# EAGLE schematic IronDue (EAGLE 9.0.1)
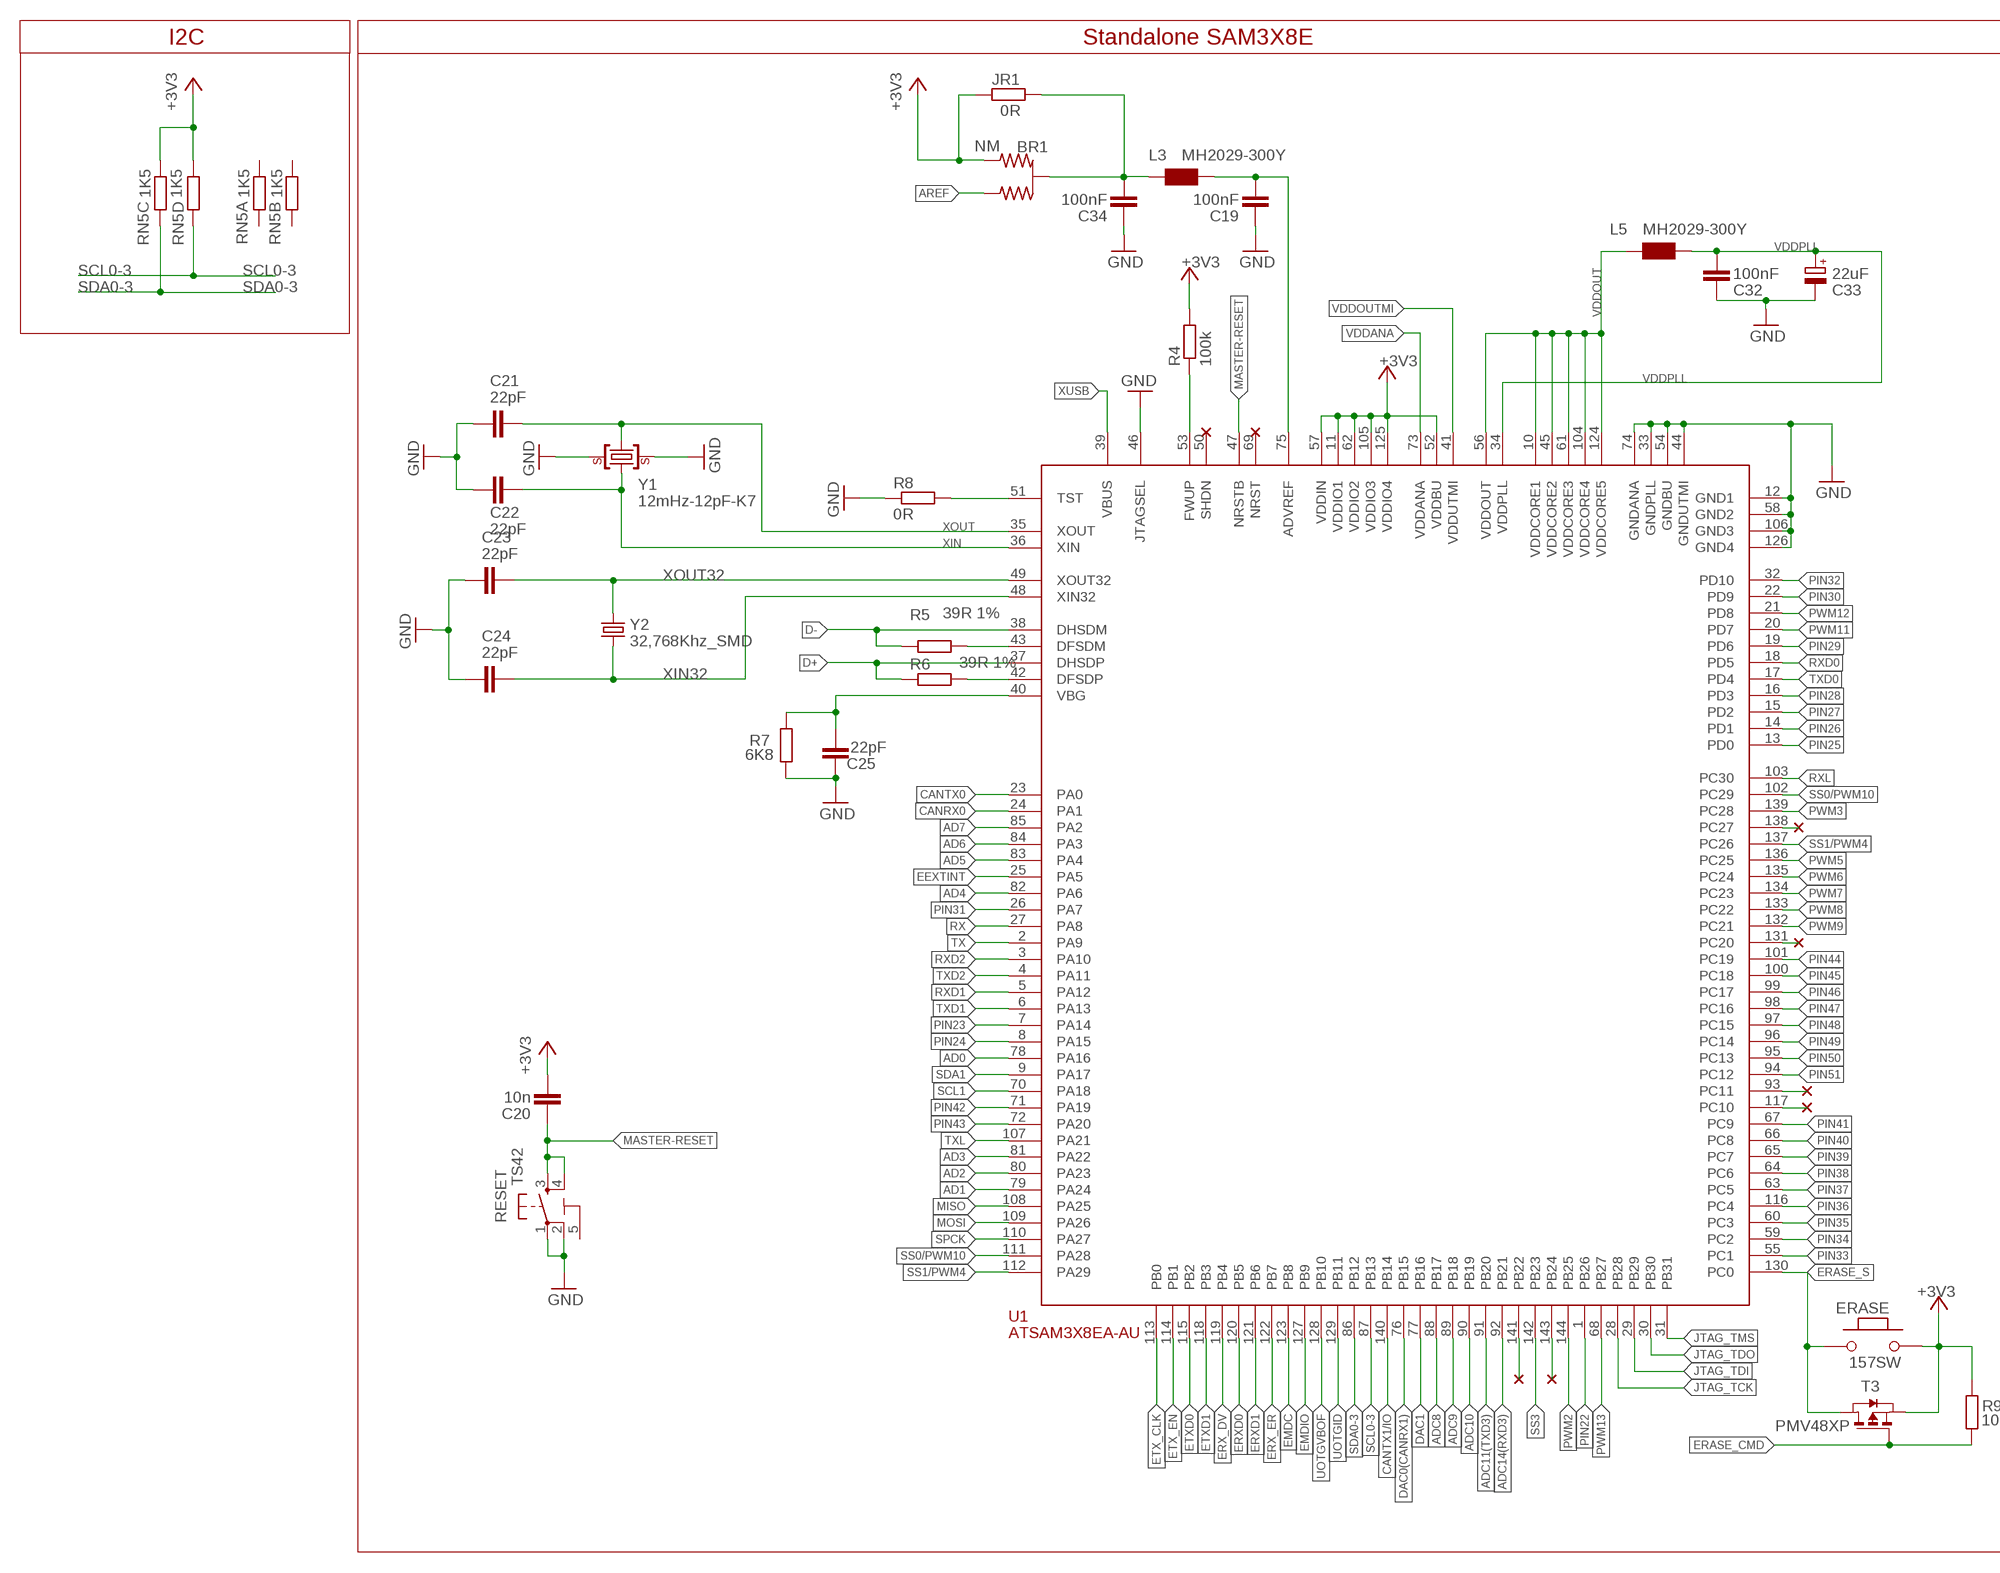
[diagram p0: schematic, sheet 1, part 1 of 2]
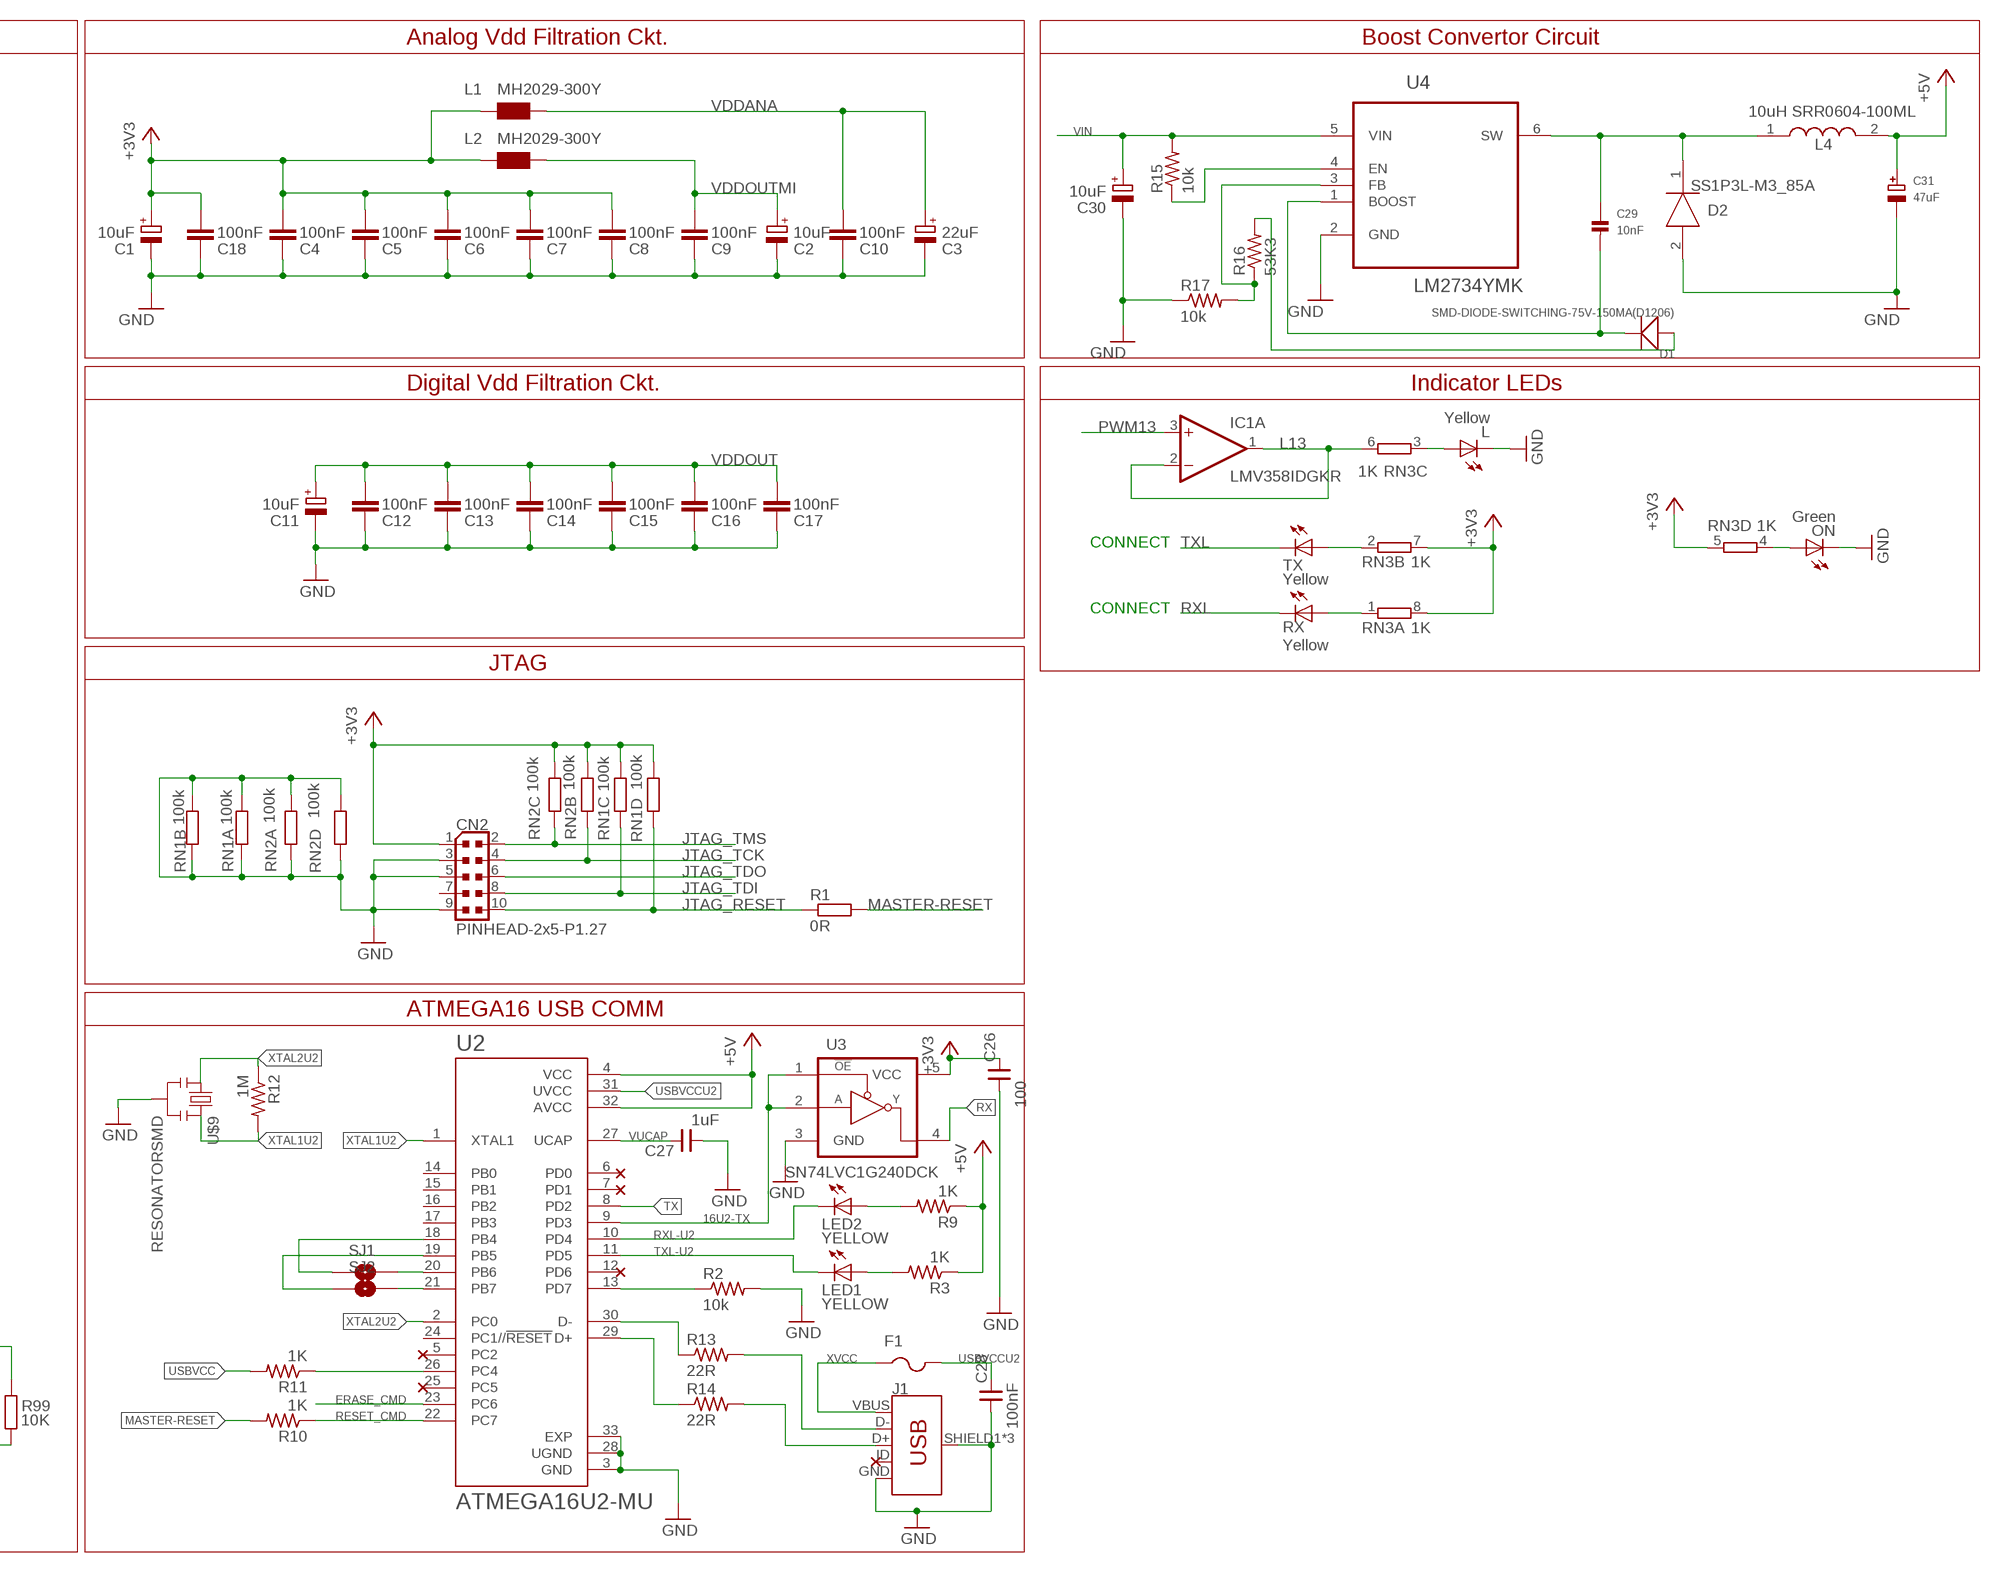
[diagram p1: schematic, sheet 1, part 2 of 2]

## Parts
BR1  NM  J0402  [J0402]
C1  10uF  0167_  [SMC_B]
C2  10uF  0167_  [SMC_B]
C3  22uF  0167_  [SMC_B]
C4  100nF  0132_100NF_0402  [C0402]
C5  100nF  0132_100NF_0402  [C0402]
C6  100nF  0132_100NF_0402  [C0402]
C7  100nF  0132_100NF_0402  [C0402]
C8  100nF  0132_100NF_0402  [C0402]
C9  100nF  0132_100NF_0402  [C0402]
C10  100nF  0132_100NF_0402  [C0402]
C11  10uF  0167_  [SMC_B]
C12  100nF  0132_100NF_0402  [C0402]
C13  100nF  0132_100NF_0402  [C0402]
C14  100nF  0132_100NF_0402  [C0402]
C15  100nF  0132_100NF_0402  [C0402]
C16  100nF  0132_100NF_0402  [C0402]
C17  100nF  0132_100NF_0402  [C0402]
C18  100nF  0132_100NF_0402  [C0402]
C19  100nF  0132_100NF_0402  [C0402]
C20  10n  0165_10NF_0402  [C0402]
C21  22pF  0137_22PF_0402  [C0402]
C22  22pF  0137_22PF_0402  [C0402]
C23  22pF  0137_22PF_0402  [C0402]
C24  22pF  0137_22PF_0402  [C0402]
C25  22pF  0137_22PF_0402  [C0402]
C26  100  CNP-0402  [0402]
C27  1uF  CNP-0402  [0402]
C28  100nF  CNP-0402  [0402]
C29  10nF  CAP_CERAMIC0402  [0402]
C30  10uF  0167_  [SMC_B]
C31  47uF  CAP_ELECTROLYTICPANASONIC_D  [PANASONIC_D]
C32  100nF  0132_100NF_0402  [C0402]
C33  22uF  0167_  [SMC_B]
C34  100nF  0132_100NF_0402  [C0402]
CN2  PINHEAD-2x5-P1.27  0171_PH127-205DF055G00AROUND-PADS  [PINHEAD_2X05_127]
D1  SMD-DIODE-SWITCHING-75V-150MA(D1206)  [LED-1206]
D2  SS1P3L-M3_85A  [SMP]
ERASE  157SW  0173_IT-1185AP1C-160G-G_T&R  [SMD_157SW]
F1  MF-MSMF050-2 500mA  PTCFUSE-1812  [1812]
IC1  LMV358IDGKR  0021_LMV358IDGKR  [MSOP08]
J1  USB_MICRO-BREDUCED_PASTE  [USB-B-MICRO-SMD_RED_PASTE]
JR1  0R  0039_JUMP_0402  [R0402]
L  Yellow  0044_KPT-2012YC  [CHIPLED_0805]
L1  MH2029-300Y  0001_BLM21PG300SN1D_/_MH2029-300Y  [0805]
L2  MH2029-300Y  0001_BLM21PG300SN1D_/_MH2029-300Y  [0805]
L3  MH2029-300Y  0001_BLM21PG300SN1D_/_MH2029-300Y  [0805]
L4  10uH SRR0604-100ML  SRR0604-100ML  [SRR0604-SERIES]
L5  MH2029-300Y  0001_BLM21PG300SN1D_/_MH2029-300Y  [0805]
LED1  YELLOW  LEDCHIPLED_0805  [CHIPLED_0805]
LED2  YELLOW  LEDCHIPLED_0805  [CHIPLED_0805]
ON  Green  0043_KPT-2012SGC  [CHIPLED_0805]
R1  0R  0039_JUMP_0402  [R0402]
R2  10k  R-US_R0402  [R0402]
R3  1K  R-US_R0402  [R0402]
R4  100k  0134_CR0402FX1003L  [R0402]
R5  39R 1%  0138_39R_0402  [R0402]
R6  39R 1%  0138_39R_0402  [R0402]
R7  6K8  0164_6K8_0603  [R0603-ROUND]
R8  0R  0039_JUMP_0402  [R0402]
R9  1K  R-US_R0402  [R0402]
R10  1K  R-US_R0402  [R0402]
R11  1K  R-US_R0402  [R0402]
R12  1M  R-US_R0402  [R0402]
R13  22R  R-US_R0402  [R0402]
R14  22R  R-US_R0402  [R0402]
R15  10k  R-US_R0402  [R0402]
R16  53K3  R-US_R0603  [R0603]
R17  10k  R-US_R0603  [R0603]
R99  10K  0136_CR0402FX1002_L  [R0402]
RESET  TS42  0946_TS42031-160W-TR-7260  [TS42]
RN1  100k  0168_CAY16-104J4LF  [CAY16]
RN2  100k  0168_CAY16-104J4LF  [CAY16]
RN3  1K  0005_064R_1K_/_CAY16-102J4LF  [CAY16]
RN5  1K5  0163_1K5_ARRAY  [CAY16]
RX  Yellow  0044_KPT-2012YC  [CHIPLED_0805]
SJ1  SOLDERJUMPERNO  [SJ_2S-NO]
SJ2  SOLDERJUMPERNO  [SJ_2S-NO]
T3  PMV48XP  0297_PMV48XP  [SOT-23]
TX  Yellow  0044_KPT-2012YC  [CHIPLED_0805]
U1  ATSAM3X8EA-AU  0162_ATSAM3X8EA-AUAU  [LQFP144]
U2  ATMEGA16U2-MU  [QFN50P500X500X100-33N]
U3  SN74LVC1G240DCK  [SC70-5]
U4  LM2734YMK  [SOT95P285X100-6N]
U$1  NC  [NC]
U$2  NC  [NC]
U$3  NC  [NC]
U$4  NC  [NC]
U$5  NC  [NC]
U$6  NC  [NC]
U$7  NC  [NC]
U$8  NC  [NC]
U$9  RESONATORSMD  [RESONATOR-SMD]
U$10  NC  [NC]
U$11  NC  [NC]
U$12  NC  [NC]
U$13  NC  [NC]
U$14  NC  [NC]
U$15  NC  [NC]
Y1  12mHz-12pF-K7  0396_12MHZ-12PF-K7  [CRYSTAL-3.2-2.5]
Y2  32,768Khz_SMD  0213_ABS07-32.768KHZ-T  [RESONATOR_EPSON_FC_145]

## Nets
16U2-TX: U2.9(PD3) U3.1(OE#) U3.2(A)
+3V3: BR1.3 C1.+ C4.2 C5.2 C6.2 C7.2 C8.2 C18.2 C20.2 C26.2 CN2.1 ERASE.1 JR1.1 L1.1 L2.1 R4.2 R99.2 RN1.5 RN1.6 RN2.2 RN2.3 RN3.5 RN3.7 RN3.8 RN5.3 RN5.4 T3.2(S) U1.11(VDDIO1) U1.52(VDDBU) U1.57(VDDIN) U1.62(VDDIO2) U1.105(VDDIO3) U1.125(VDDIO4) U3.5(VCC)
+5V: C31.+ L4.2 R3.1 R9.1 U2.4(VCC) U2.32(AVCC)
AD0: U1.78(PA16)
AD1: U1.79(PA24)
AD2: U1.80(PA23)
AD3: U1.81(PA22)
AD4: U1.82(PA6)
AD5: U1.83(PA4)
AD6: U1.84(PA3)
AD7: U1.85(PA2)
ADC8: U1.88(PB17)
ADC9: U1.89(PB18)
ADC10: U1.90(PB19)
ADC11(TXD3): U1.91(PB20)
ADC14(RXD3): U1.92(PB21)
AREF: BR1.1
CANRX0: U1.24(PA1)
CANTX0: U1.23(PA0)
CANTX1/IO: U1.140(PB14)
D+: R6.1 U1.37(DHSDP)
D-: R5.1 U1.38(DHSDM)
DAC0(CANRX1): U1.76(PB15)
DAC1: U1.77(PB16)
EEXTINT: U1.25(PA5)
EMDC: U1.123(PB8)
EMDIO: U1.127(PB9)
ERASE_CMD: R99.1 T3.3(G) U2.23(PC6)
ERASE_S: ERASE.2 T3.1(D) U1.130(PC0)
ERX_DV: U1.119(PB4)
ERX_ER: U1.122(PB7)
ERXD0: U1.120(PB5)
ERXD1: U1.121(PB6)
ETX_CLK: U1.113(PB0)
ETX_EN: U1.114(PB1)
ETXD0: U1.115(PB2)
ETXD1: U1.118(PB3)
GND: C1.- C2.- C3.- C4.1 C5.1 C6.1 C7.1 C8.1 C9.1 C10.1 C11.- C12.1 C13.1 C14.1 C15.1 C16.1 C17.1 C18.1 C19.1 C21.2 C22.2 C23.2 C24.2 C25.2 C26.1 C27.1 C28.1 C30.- C31.- C32.1 C33.- C34.1 CN2.3 CN2.5 CN2.9 D2.2(K) J1.GND J1.SHIELD1(SHIELD) J1.SHIELD2(SHIELD) J1.SHIELD3(SHIELD) L.C ON.C R2.2 R7.1 R8.1 R17.1 RESET.1 RESET.2 RN1.1 RN1.2 RN1.7 RN1.8 RN2.1 RN2.4 RN2.5 RN2.8 U1.12(GND1) U1.33(GNDPLL) U1.44(GNDUTMI) U1.46(JTAGSEL) U1.54(GNDBU) U1.58(GND2) U1.74(GNDANA) U1.106(GND3) U1.126(GND4) U2.3(GND) U2.28(UGND) U2.33(EXP) U3.3(GND) U4.2(GND) U$9.2 Y1.2(GND) Y1.4(GND)
JTAG_RESET: CN2.10 R1.1 RN1.4
JTAG_TCK: CN2.4 RN2.7 U1.28(PB28)
JTAG_TDI: CN2.8 RN1.3 U1.29(PB29)
JTAG_TDO: CN2.6 U1.30(PB30)
JTAG_TMS: CN2.2 RN2.6 U1.31(PB31)
L13: IC1.1(A:OUT) IC1.2(A:-IN) RN3.6
MASTER-RESET: C20.1 R1.2 R10.2 RESET.3 RESET.4 U1.47(NRSTB)
MISO: U1.108(PA25)
MOSI: U1.109(PA26)
N$1: R4.1 U1.53(FWUP)
N$2: C19.2 L3.2 U1.75(ADVREF)
N$3: BR1.2(C) C34.2 JR1.2 L3.1
N$4: ON.A RN3.4
N$5: L.A RN3.3
N$6: U1.131(PC20)
N$7: U1.138(PC27)
N$8: U1.93(PC11)
N$9: U1.117(PC10)
N$10: U1.143(PB24)
N$11: U1.141(PB22)
N$12: R8.2 U1.51(TST)
N$13: R6.2 U1.42(DFSDP)
N$14: R5.2 U1.43(DFSDM)
N$15: C25.1 R7.2 U1.40(VBG)
N$16: R2.1 U2.13(PD7)
N$17: LED2.A R9.2
N$18: LED1.A R3.2
N$19: R11.1 U2.26(PC4)
N$20: R13.1 U2.30(D-)
N$21: R14.1 U2.29(D+)
N$22: J1.D+ R14.2
N$23: J1.D- R13.2
N$24: C29.2 D1.- U4.1(BOOST)
N$25: R16.1 R17.2 U4.3(FB)
N$26: SJ1.2 U2.20(PB6)
N$27: SJ2.2 U2.21(PB7)
N$28: SJ1.1 U2.18(PB4)
N$29: SJ2.1 U2.19(PB5)
N$30: C29.1 D2.1(A) L4.1 U4.6(SW)
N$31: D1.+ R16.2
N$32: R15.1 U4.4(EN)
N$54: RN3.1 RX.A
N$55: RN3.2 TX.A
PIN22: U1.1(PB26)
PIN23: U1.7(PA14)
PIN24: U1.8(PA15)
PIN25: U1.13(PD0)
PIN26: U1.14(PD1)
PIN27: U1.15(PD2)
PIN28: U1.16(PD3)
PIN29: U1.19(PD6)
PIN30: U1.22(PD9)
PIN31: U1.26(PA7)
PIN32: U1.32(PD10)
PIN33: U1.55(PC1)
PIN34: U1.59(PC2)
PIN35: U1.60(PC3)
PIN36: U1.116(PC4)
PIN37: U1.63(PC5)
PIN38: U1.64(PC6)
PIN39: U1.65(PC7)
PIN40: U1.66(PC8)
PIN41: U1.67(PC9)
PIN42: U1.71(PA19)
PIN43: U1.72(PA20)
PIN44: U1.101(PC19)
PIN45: U1.100(PC18)
PIN46: U1.99(PC17)
PIN47: U1.98(PC16)
PIN48: U1.97(PC15)
PIN49: U1.96(PC14)
PIN50: U1.95(PC13)
PIN51: U1.94(PC12)
PWM2: U1.144(PB25)
PWM3: U1.139(PC28)
PWM5: U1.136(PC25)
PWM6: U1.135(PC24)
PWM7: U1.134(PC23)
PWM8: U1.133(PC22)
PWM9: U1.132(PC21)
PWM11: U1.20(PD7)
PWM12: U1.21(PD8)
PWM13: IC1.3(A:+IN) U1.68(PB27)
RESET_CMD: R10.1 U2.22(PC7)
RX: U1.27(PA8) U3.4(Y)
RXD0: U1.18(PD5)
RXD1: U1.5(PA12)
RXD2: U1.3(PA10)
RXL: RX.C U1.103(PC30)
RXL-U2: LED2.C U2.10(PD4)
SCL0-3: RN5.5 U1.87(PB13)
SCL1: U1.70(PA18)
SDA0-3: RN5.6 U1.86(PB12)
SDA1: U1.9(PA17)
SPCK: U1.110(PA27)
SS0/PWM10: U1.102(PC29) U1.111(PA28)
SS1/PWM4: U1.112(PA29) U1.137(PC26)
SS3: U1.142(PB23)
TX: U1.2(PA9) U2.8(PD2)
TXD0: U1.17(PD4)
TXD1: U1.6(PA13)
TXD2: U1.4(PA11)
TXL: TX.C U1.107(PA21)
TXL-U2: LED1.C U2.11(PD5)
UOTGID: U1.129(PB11)
UOTGVBOF: U1.128(PB10)
USBVCC: R11.2
USBVCCU2: C28.2 F1.2 U2.31(UVCC)
VDDANA: C3.+ C10.2 L1.2 U1.73(VDDANA)
VDDOUT: C11.+ C12.2 C13.2 C14.2 C15.2 C16.2 C17.2 L5.1 U1.10(VDDCORE1) U1.45(VDDCORE2) U1.56(VDDOUT) U1.61(VDDCORE3) U1.104(VDDCORE4) U1.124(VDDCORE5)
VDDOUTMI: C2.+ C9.2 L2.2 U1.41(VDDUTMI)
VDDPLL: C32.2 C33.+ L5.2 U1.34(VDDPLL)
VIN: C30.+ R15.2 U4.5(VIN)
VUCAP: C27.2 U2.27(UCAP)
XIN: C22.1 U1.36(XIN) Y1.1(C1)
XIN32: C24.1 U1.48(XIN32) Y2.P$2
XOUT: C21.1 U1.35(XOUT) Y1.3(C2)
XOUT32: C23.1 U1.49(XOUT32) Y2.P$1
XTAL1U2: R12.2 U2.1(XTAL1) U$9.3
XTAL2U2: R12.1 U2.2(PC0) U$9.1
XUSB: U1.39(VBUS)
XVCC: F1.1 J1.VBUS
Unconnected: CN2.7 IC1.5(B:+IN) IC1.6(B:-IN) IC1.7(B:OUT) J1.ID RN5.1 RN5.2 RN5.7 RN5.8 U1.50(SHDN) U1.69(NRST) U2.5(PC2) U2.6(PD0) U2.7(PD1) U2.12(PD6) U2.14(PB0) U2.15(PB1) U2.16(PB2) U2.17(PB3) U2.24(PC1//!RESET) U2.25(PC5)

## Notes on the sheet
- I2C | Standalone SAM3X8E | Analog Vdd Filtration Ckt. | Boost Convertor Circuit
- Digital Vdd Filtration Ckt. | Indicator LEDs
- CONNECT
- CONNECT
- JTAG
- ATMEGA16 USB COMM

## Power pins joined to a net without a drawn wire
5-GND: RESET.5(5-GND)
V+: IC1.8(P:V+)
V-: IC1.4(P:V-)

## Library data of the parts
BR1 = bibaja:J: Three terminal jumper made from two 0402, 0603, 0805, etc.
C1 C2 C11 C30 = Condensatori:0167_: 22uF 25V; MONTHLY_USAGE: _____; PRICE: _____; SUPPLIER: _____; TYPE: Condensatori; VALUE: 22uF
C3 C33 = Condensatori:0167_: 22uF 25V; MONTHLY_USAGE: _____; PRICE: _____; SUPPLIER: _____; TYPE: Condensatori
C4-C10 C12-C19 C32 C34 = Condensatori:0132_100NF_0402: 100nF 0402; CASE: 0402; MONTHLY_USAGE: _____; PART_NUMBER: 100nF_0402; PRICE: _____; SUPPLIER: _____; TYPE: Condensatori
C20 = Condensatori:0165_10NF_0402: 10nF 0402
C21-C25 = Condensatori:0137_22PF_0402: 22pF 0402; CASE: 0402; MONTHLY_USAGE: _____; PART_NUMBER: 22pF_0402; PRICE: _____; SUPPLIER: _____; TYPE: Condensatori
C26-C28 = cap-master:CNP-: NON-POLARIZED CAP
C29 = microbuilder:CAP_CERAMIC: Ceramic Capacitors 0402 - 0402 Surface Mount Capacitors 16pF 50V 5% [Digikey: 445-4899-2-ND] 18pF 50V 5% [Digikey: 490-1281-2-ND] 22pF 50V 5% [Digikey: 490-1283-2-ND] 68pF 50V 5% [Digikey: 490-1289-2-ND] 0.1uF 10V 10% [Digikey: 490-1318-2-ND] 1.0uF 6.3V 10% [Digikey: 490-1320-2-ND] 0603 - 0603 Surface Mount Capacitors 16 pF 50V 5% [Digikey: 445-5051-2-ND] 22 pF 50V [Digikey: PCC220ACVTR-ND] 33 pF 50V 5% [Digikey: 490-1415-1-ND] 56pF 50V 5% [Digikey: 490-1421-1-ND] 220pF 50V 5% [Digikey: 445-1285-1-ND] 680 pF 50V 2200 pF 50V 5% C0G [Digikey: 445-1297-1-ND] 5600 pF 100V 5% X7R [Digikey: 478-3711-1-ND] 0.1 µF 25V 10% [Digikey: PCC2277TR-ND] 0.22 µF 16V 10% X7R [Digikey: 445-1318-1-ND] 1.0 µF 25V 10% [Digikey: 445-5146-2-ND] 0603 - RF Specific 3pF 250V +/-0.1pF RF [Digikey: 712-1347-1-ND] 18 pF 250V 5% [Digikey: 478-3505-1-ND or 712-1322-1-ND] 56 pF 250V 5% C0G RF [Digikey: 490-4867-1-ND] 68 pF 250V RF [Digikey: 490-4868-1-ND] 0805 - 0805 Surface Mount Capacitors 220 pF 250V 2% RF Ceramic Capacitor [Digikey: 712-1398-1-ND] 1000 pF 50V 2% NP0 Ceramic Capacitor [Digikey: 478-3760-1-ND] 0.1 µF 25V 10% Ceramic Capacitor [Digikey: PCC1828TR-ND] 1.0 µF 16V 10% Ceramic Capacitor[Digikey: 490-1691-2-ND] 10.0 µF 10V 10% Ceramic Capacitor[Digikey: 709-1228-1-ND] 10.0 uF 16V 10% Ceramic Capacitor [Digikey: 478-5165-2-ND] 47 uF 6.3V 20% Ceramic Capacitor [Digikey: 587-1779-1-ND or 399-5506-1-ND] 1206 - 1206 Surface Mount Capacitors 47uF 10V 20% Ceramic Capacitor [Digikey: 490-5528-1-ND or 399-5508-1-ND or 445-6010-1-ND]
C31 = microbuilder:CAP_ELECTROLYTIC: Electrolytic Capacitors PANASONIC_C - Size C Panasonic Electrolytic Aluminum Capacitor 47µF 16V 20% Electrolytic Capacitor [Digikey: PCE3890TR-ND] PANASONIC_D - Size D Panasonic Electrolytic Aluminum Capacitor 100µF 25V 20% Electrolytic Capacitor [Digikey: PCE3898TR-ND]
CN2 = Connettori:0171_PH127-205DF055G00A: 2x5 PASSO 1,27
D1 = SMD-DIODE-SWITCHING-75V-150MA_D1206_:SMD-DIODE-SWITCHING-75V-150MA(D1206): 304040005; AVAILABILITY: Unavailable; DESCRIPTION: Diode Small Signal Switching 100V 0.15A 2-Pin Case 1206; MF: Bourns; MP: CD1206-S01575; PACKAGE: 1206 Bourns; PRICE: None
D2 = SamacSys_Parts:SS1P3L-M3_85A: Schottky Diodes & Rectifiers 30volt 1.0amp Source: Datasheet <https://www.vishay.com/docs/88915/ss1p3l.pdf>; DESCRIPTION: Schottky Diodes & Rectifiers 30volt 1.0amp; HEIGHT: mm; MANUFACTURER_NAME: Vishay; MANUFACTURER_PART_NUMBER: SS1P3L-M3/85A; MOUSER_PART_NUMBER: 625-SS1P3L-M3/85A; MOUSER_PRICE-STOCK: https://www.mouser.com/Search/Refine.aspx?Keyword=625-SS1P3L-M3%2F85A
ERASE = Switches:0173_IT-1185AP1C-160G-G_T&R: Pushbutton 4x3 SMD H2,5mm; MONTHLY_USAGE: _____; PART_NUMBER: IT-1185AP1C-160G-G_T&R; PRICE: _____; SUPPLIER: _____; TYPE: Switches
F1 = adafruit:PTCFUSE: PTC fuses, resettable thermistors
IC1 = IntegratedCircuits:0021_LMV358IDGKR: Dual low-voltage (2.7 V to 5.5 V), operational amplifiers with rail-to-rail output swing LMV358IDGKR; CASE: MSOP8; MONTHLY_USAGE: _____; PART_NUMBER: LMV358IDGKR; PRICE: _____; SUPPLIER: _____; TYPE: Circuito_Integrato
J1 = SparkFun-Connectors:USB_MICRO-B: USB Type Micro-B Connector Male/female and PTH/SMT variants SparkFun Products: SparkFun microB USB Breakout <https://www.sparkfun.com/products/12035> SparkFun USB microB Plug Breakout <https://www.sparkfun.com/products/10031> SparkFun ESP8266 Thing <https://www.sparkfun.com/products/13231>; PROD_ID: CONN-11752
JR1 R1 R8 = Resistenze:0039_JUMP_0402: 0R 0402; CASE: 0402; MONTHLY_USAGE: _____; PART_NUMBER: JUMP_0402; PRICE: _____; SUPPLIER: _____; TYPE: Resistenze
L RX TX = Opto:0044_KPT-2012YC: LED YELLOW - SMD - 0805; MONTHLY_USAGE: _____; PART_NUMBER: KPT-2012YC; PRICE: _____; SUPPLIER: _____; TYPE: Opto
L1-L3 L5 = Protezione:0001_BLM21PG300SN1D_/_MH2029-300Y: BLM21; MONTHLY_USAGE: _____; PART_NUMBER: BLM21PG300SN1D_/_MH2029-300Y; PRICE: _____; SUPPLIER: _____; TYPE: Protezione
L4 = SamacSys_Parts:SRR0604-100ML: Power inductor SMD shielded 10uH Bourns SRR0604 Series Shielded Wire-wound SMD Inductor with a Ferrite Core, 10 ??H ??20% 1.8A Idc Q:18 Source: Datasheet <http://docs-emea.rs-online.com/webdocs/0fa5/0900766b80fa5950.pdf>; ALLIED_NUMBER: 70276646; ALLIED_PRICE-STOCK: http://www.alliedelec.com/bourns-srr0604-100ml/70276646/; DESCRIPTION: Power inductor SMD shielded 10uH Bourns SRR0604 Series Shielded Wire-wound SMD Inductor with a Ferrite Core, 10 ??H ??20% 1.8A Idc Q:18; HEIGHT: mm; MANUFACTURER_NAME: Bourns; MANUFACTURER_PART_NUMBER: SRR0604-100ML; MOUSER_PART_NUMBER: 652-SRR0604-100ML; MOUSER_PRICE-STOCK: https://www.mouser.com/Search/Refine.aspx?Keyword=652-SRR0604-100ML; RS_PART_NUMBER: 1728488; RS_PRICE-STOCK: http://uk.rs-online.com/web/p/products/1728488
LED1 LED2 = adafruit:LED: LED OSRAM: - CHIPLED LG R971, LG N971, LY N971, LG Q971, LY Q971, LO R971, LY R971 LH N974, LH R974 LS Q976, LO Q976, LY Q976 LO Q996 - Hyper CHIPLED LW Q18S LB Q993, LB Q99A, LB R99A - SideLED LS A670, LO A670, LY A670, LG A670, LP A670 LB A673, LV A673, LT A673, LW A673 LH A674 LY A675 LS A676, LA A676, LO A676, LY A676, LW A676 LS A679, LY A679, LG A679 - Hyper Micro SIDELED® LS Y876, LA Y876, LO Y876, LY Y876 LT Y87S - SmartLED LW L88C, LW L88S LB L89C, LB L89S, LG L890 LS L89K, LO L89K, LY L89K LS L896, LA L896, LO L896, LY L896 - TOPLED LS T670, LO T670, LY T670, LG T670, LP T670 LSG T670, LSP T670, LSY T670, LOP T670, LYG T670 LG T671, LOG T671, LSG T671 LB T673, LV T673, LT T673, LW T673 LH T674 LS T676, LA T676, LO T676, LY T676, LB T676, LH T676, LSB T676, LW T676 LB T67C, LV T67C, LT T67C, LS T67K, LO T67K, LY T67K, LW E67C LS E67B, LA E67B, LO E67B, LY E67B, LB E67C, LV E67C, LT E67C LW T67C LS T679, LY T679, LG T679 LS T770, LO T770, LY T770, LG T770, LP T770 LB T773, LV T773, LT T773, LW T773 LH T774 LS E675, LA E675, LY E675, LS T675 LS T776, LA T776, LO T776, LY T776, LB T776 LHGB T686 LT T68C, LB T68C - Hyper Mini TOPLED® LB M676 - Mini TOPLED Santana® LG M470 LS M47K, LO M47K, LY M47K Source: http://www.osram.convergy.de/
ON = Opto:0043_KPT-2012SGC: LED GREEN - SMD-0805; MONTHLY_USAGE: _____; PART_NUMBER: KPT-2012SGC; PRICE: _____; SUPPLIER: _____; TYPE: Opto
R2 R3 R9-R17 = adafruit:R-US_: RESISTOR, American symbol
R4 = Resistenze:0134_CR0402FX1003L: 100K 0402; CASE: 0402; PART_NUMBER: CR0402FX1003 L; TYPE: Resistenze
R5 R6 = Resistenze:0138_39R_0402: 39R 0402
R7 = Resistenze:0164_6K8_0603: 6K8 0603; CASE: 0603; MONTHLY_USAGE: _____; PART_NUMBER: 6K8_0603; PRICE: _____; SUPPLIER: _____; TYPE: Resistenze
R99 = Resistenze:0136_CR0402FX1002_L: 10K 0402; CASE: 0402; MONTHLY_USAGE: _____; PART_NUMBER: CR0402FX1002_L; PRICE: _____; SUPPLIER: _____; TYPE: Resistenze
RESET = Switches:0946_TS42031-160W-TR-7260: Pushbutton 6x6 Smd - White; MONTHLY_USAGE: _____; PART_NUMBER: IT-1157AHNP-160G-G_GTR; PRICE: _____; SUPPLIER: _____; TYPE: Switches
RN1 RN2 = Resistenze:0168_CAY16-104J4LF: 100K 064 R; CASE: SMD 3,2x1,6; PART_NUMBER: CAY16-104J4LF; TYPE: Resistenze
RN3 = Resistenze:0005_064R_1K_/_CAY16-102J4LF: 1K 064R; CASE: SMD_3,2x1,6; MONTHLY_USAGE: _____; PART_NUMBER: 064R_1K_/_CAY16-102J4LF; PRICE: _____; SUPPLIER: _____; TYPE: Resistenze
RN5 = Resistenze:0163_1K5_ARRAY: 1K5 064 R
SJ1 SJ2 = SparkFun:SOLDERJUMPER: Solder Jumper Standard SMD solder jumper. Used to automate production. Two varients : Normally Open and Normally Closed are the same, but have different paste layers. NC will have a large amount of paste and should jumper during reflow.
T3 = Transistors:0297_PMV48XP: 20 V, 3.5 A P-channel Trench MOSFET - PMV48XP; CASE: SOT23; MONTHLY_USAGE: _____; PART_NUMBER: PMV48XP; PRICE: _____; SUPPLIER: _____; TYPE: Transistor
U1 = IntegratedCircuits:0162_ATSAM3X8EA-AU: AT91SAM ARM-based Flash MCU ATSAM3X8EA-AU; CASE: LQFP144; PART_NUMBER: ATSAM3X8EA-AU; TYPE: Circuito_Integrato
U2 = ATMEGA16U2-MU:ATMEGA16U2-MU: Avr Usb 8k Flash - Avr Usb 16k Flash Qfn32 Industrial Optim; AVAILABILITY: Unavailable; DESCRIPTION: Embedded microcontroller ATMEGA16U2-MU VQFN 32 _5x5_ Microchip Technology 8-Bit 16 MHz I/O number 22; MF: Microchip; MP: ATMEGA16U2-MU; PACKAGE: VQFN-32 Microchip; PRICE: None
U3 = 74LV:SN74LVC1G240: SINGLE BUFFER/DRIVER WITH 3-STATE OUTPUT
U4 = LM2734YMK:LM2734YMK: Step-Down DC-DC Regulator; AVAILABILITY: Unavailable; DESCRIPTION: Thin SOT23 1A Load Step-Down DC-DC Regulator 6-SOT -40 to 125; MF: Texas Instruments; MP: LM2734YMK/NOPB; PACKAGE: TSOT-23 Texas Instruments; PRICE: None
U$1-U$8 U$10-U$15 = divers:NC: No connect symbol
U$9 = SparkFun:RESONATOR: Resonator Small SMD resonator. This is the itty bitty 10/20MHz resonators with built in caps. CSTCE10M0G55 and CSTCE20M0V53. Footprint has been reviewed closely but hasn't been tested yet.
Y1 = Cristalli:0396_12MHZ-12PF-K7: 12Mhz - K7 12pF - SMD
Y2 = Cristalli:0213_ABS07-32.768KHZ-T: 32,768KHz - SMD; MONTHLY_USAGE: _____; PART_NUMBER: ABS07-32.768KHZ-T; PRICE: _____; SUPPLIER: _____; TYPE: Cristalli

## Net classes
0 default: width 0.203 mm, drill 0.406 mm, clearance 0.203 mm